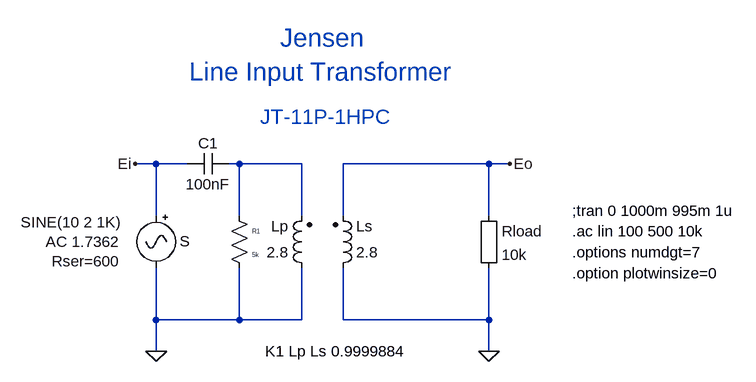
[diagram p0: schematic JT-11P-1HPC-Dhiru.asc]
JT-11P-1HPC-Dhiru.asc, the LTspice schematic file:
Version 4
SHEET 1 2372 788
WIRE 0 48 -32 48
WIRE 48 48 0 48
WIRE 128 48 112 48
WIRE 224 48 128 48
WIRE 512 48 288 48
WIRE 544 48 512 48
WIRE 0 128 0 48
WIRE 128 128 128 48
WIRE 224 128 224 48
WIRE 288 128 288 48
WIRE 512 128 512 48
WIRE 0 288 0 208
WIRE 128 288 128 208
WIRE 128 288 0 288
WIRE 224 288 224 208
WIRE 224 288 128 288
WIRE 288 288 288 208
WIRE 512 288 512 208
WIRE 512 288 288 288
WIRE 0 336 0 288
WIRE 512 336 512 288
FLAG 512 336 0
FLAG 544 48 Eo
FLAG -32 48 Ei
FLAG 0 336 0
SYMBOL ind2 240 224 R180
WINDOW 0 36 80 Left 2
WINDOW 3 36 40 Left 2
SYMATTR InstName Lp
SYMATTR Value 2.8
SYMATTR Type ind
SYMATTR SpiceLine Ipk=12m Rser=66 Cpar=105p
SYMBOL ind2 272 224 M180
WINDOW 0 36 80 Left 2
WINDOW 3 36 40 Left 2
SYMATTR InstName Ls
SYMATTR Value 2.8
SYMATTR Type ind
SYMATTR SpiceLine Ipk=12m Rser=66 Cpar=115p
SYMBOL Misc\\signal 0 112 M0
WINDOW 0 -52 55 Left 2
WINDOW 3 53 26 Left 2
WINDOW 123 56 56 Left 2
WINDOW 39 55 86 Left 2
SYMATTR InstName S
SYMATTR Value SINE(10 2 1K)
SYMATTR Value2 AC 1.7362
SYMATTR SpiceLine Rser=600
SYMBOL Misc\\EuropeanResistor 496 112 R0
SYMATTR InstName Rload
SYMATTR Value 10k
SYMBOL cap 112 32 R90
WINDOW 0 0 32 VBottom 2
WINDOW 3 32 32 VTop 2
SYMATTR InstName C1
SYMATTR Value 100nF
SYMBOL res 112 112 R0
WINDOW 0 36 40 Left 0
WINDOW 3 36 76 Left 0
SYMATTR InstName R1
SYMATTR Value 5k
TEXT 168 336 Left 2 !K1 Lp Ls 0.9999884
TEXT 640 152 Left 2 !.ac lin 100 500 10k
TEXT 256 -120 Center 4 ;Jensen\nLine Input Transformer
TEXT 160 -24 Left 3 ;JT-11P-1HPC
TEXT 640 120 Left 2 !;tran 0 1000m 995m 1u
TEXT 640 216 Left 2 !.option plotwinsize=0
TEXT 640 184 Left 2 !.options numdgt=7

The netlist it stands for:
* JT-11P-1HPC-Dhiru.asc
Lp 0 N001 2.8 Ipk=12m Rser=66 Cpar=105p
Ls 0 Eo 2.8 Ipk=12m Rser=66 Cpar=115p
V§S Ei 0 SINE(10 2 1K) AC 1.7362 Rser=600
Rload Eo 0 10k
C1 N001 Ei 100nF
R1 N001 0 5k
K1 Lp Ls 0.9999884
.ac lin 100 500 10k
* Jensen
* Line Input Transformer
* JT-11P-1HPC
;tran 0 1000m 995m 1u
.option plotwinsize=0
.options numdgt=7
.backanno
.end